# EAGLE design BMSMaster (EAGLE 6.6.0)

## Sheet 1 of 2
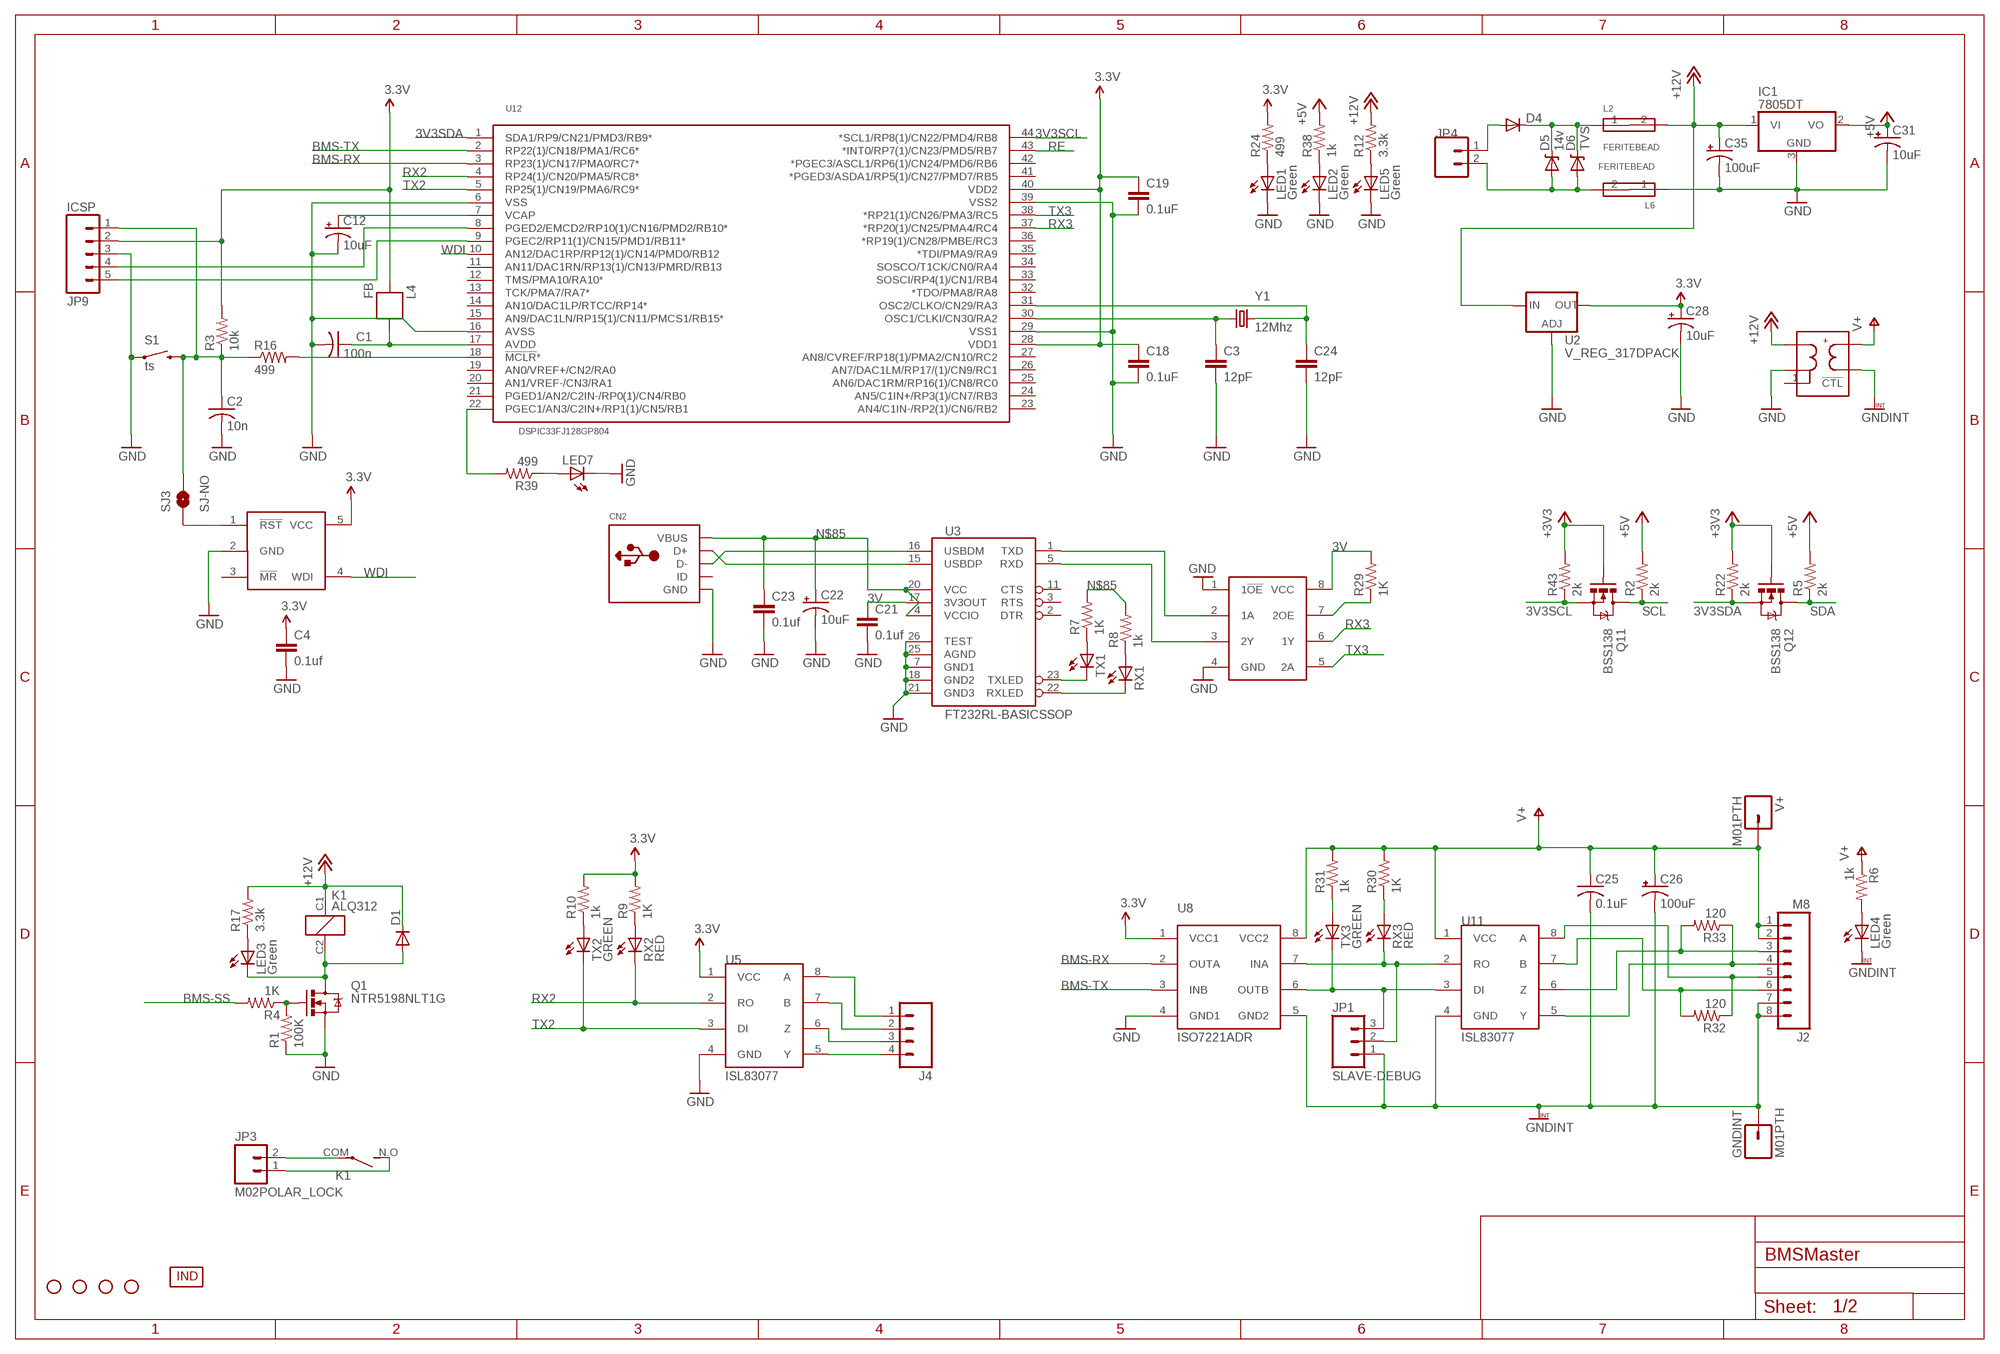
[diagram p0: schematic, sheet 1]

### Parts
C1  100n  C-USC0805  [C0805]
C2  10n  C-USC0805  [C0805]
C3  12pF  CAP0805  [0805]
C4  0.1uf  CAP0805  [0805]
C12  10uF  10UF-TANT  [EIA3216]
C18  0.1uF  CAP0805  [0805]
C19  0.1uF  CAP0805  [0805]
C21  0.1uf  CAP0805  [0805]
C22  10uF  CAP_POL1206  [EIA3216]
C23  0.1uf  CAP0805  [0805]
C24  12pF  CAP0805  [0805]
C25  0.1uF  C-USC0805  [C0805]
C26  100uF  CPOL-USC/6032-28W  [C/6032-28W]
C28  10uF  POLCAP  [POLC1206]
C31  10uF  10UF-16V-10%(TANT)  [EIA3216]
C35  100uF  CPOL-USCT7343  [CT7343]
CN2  USBMOLEX  [USB-MINIB-THM-MOLEX]
D1  DIODESMB  [SMB-DIODE]
D4  DIODESMA  [SMA-DIODE]
D5  14v  DIODE-ZENERSMB  [SMB-DIODE]
D6  TVS  [DO-214AC]
GNDINT  M01PTH  [1X01]
IC1  7805DT  [TO252]
J2  M8  [75869-132LF]
J4  M04POLAR_LOCK  [MOLEX-1X4_LOCK]
JP1  SLAVE-DEBUG  M03LOCK_LONGPADS  [1X03_LOCK_LONGPADS]
JP3  M02POLAR_LOCK  [MOLEX-1X2_LOCK]
JP4  M02POLAR_LOCK  [MOLEX-1X2_LOCK]
JP9  ICSP  M05LOCK_LONGPADS  [1X05_LOCK_LONGPADS]
K1  ALQ312  [ALQ312]
L2  FERITEBEAD  [0603]
L4  FB  [0603]
L6  FERITEBEAD  [0603]
LED1  Green  LEDCHIPLED_0805  [CHIPLED_0805]
LED2  Green  LEDCHIPLED_0805  [CHIPLED_0805]
LED3  Green  LEDCHIPLED_0805  [CHIPLED_0805]
LED4  Green  LEDCHIPLED_0805  [CHIPLED_0805]
LED5  Green  LEDCHIPLED_0805  [CHIPLED_0805]
LED7  LEDCHIP-LED0805  [CHIP-LED0805]
Q1  NTR5198NLT1G  MOSFET-NCHANNELBSS123LT1G  [SOT23]
Q11  BSS138  MOSFET-NCHANNELSMD  [SOT23-3]
Q12  BSS138  MOSFET-NCHANNELSMD  [SOT23-3]
R1  100K  R-US_R0805  [R0805]
R2  2k  R-US_R0805  [R0805]
R3  10k  RESISTOR0805-RES  [0805]
R4  1K  R-US_R0805  [R0805]
R5  2k  R-US_R0805  [R0805]
R6  1k  R-US_R0805  [R0805]
R7  1K  R-US_R0805  [R0805]
R8  1k  R-US_R0805  [R0805]
R9  1K  R-US_R0805  [R0805]
R10  1k  R-US_R0805  [R0805]
R12  3.3k  R-US_R0805  [R0805]
R16  499  RESISTOR0805-RES  [0805]
R17  3.3k  R-US_R0805  [R0805]
R22  2k  R-US_R0805  [R0805]
R24  499  R-US_R0805  [R0805]
R29  1K  R-US_R0805  [R0805]
R30  1K  R-US_R0805  [R0805]
R31  1k  R-US_R0805  [R0805]
R32  120  R-US_R0805  [R0805]
R33  120  R-US_R0805  [R0805]
R38  1k  R-US_R0805  [R0805]
R39  499  RESISTOR0805-RES  [0805]
R43  2k  R-US_R0805  [R0805]
RX1  LEDCHIPLED_0805  [CHIPLED_0805]
RX2  RED  LEDCHIPLED_0805  [CHIPLED_0805]
RX3  RED  LEDCHIPLED_0805  [CHIPLED_0805]
S1  ts  SWITCH-MOMENTARY-2SIDE_EZ  [TACTILE-PTH-SIDEEZ]
SJ3  SJ-NO  SOLDERJUMPERNO  [SJ_2S-NO]
STANDOFF1  STAND-OFF  [STAND-OFF]
STANDOFF2  STAND-OFF  [STAND-OFF]
STANDOFF3  STAND-OFF  [STAND-OFF]
STANDOFF4  STAND-OFF  [STAND-OFF]
TX1  LEDCHIPLED_0805  [CHIPLED_0805]
TX2  GREEN  LEDCHIPLED_0805  [CHIPLED_0805]
TX3  GREEN  LEDCHIPLED_0805  [CHIPLED_0805]
U2  V_REG_317DPACK  [V-REG_DPACK]
U3  FT232RL-BASICSSOP  [SSOP28DB]
U4  SN74LVC2G241DCTR  [VFSOP-8]
U5  ISL83077  [SO08]
U8  ISO7221ADR  [SOIC-8]
U9  MAX823  [SOT23-5L]
U11  ISL83077  [SO08]
U12  DSPIC33FJ128GP804  [TQFP-44]
U21  REC7.5-1205SRW/H2/A/M  [24DIPMOD-8LEAD]
U$1  INDPK1  [PICKIT-PIN-1]
V+  M01PTH  [1X01]
Y1  12Mhz  CRYSTAL5X3  [CRYSTAL-SMD-5X3]

### Nets
3.3V: C4.1 C18.1 C19.1 C28.1(+) JP9.2 L4.2 R3.2 R9.2 R10.2 R24.2 U2.4(OUT) U5.1(VCC) U8.1(VCC1) U9.5(VCC) U12.28(VDD1) U12.40(VDD2)
3V: C21.1 R29.2 U3.17(3V3OUT) U4.8(VCC)
3V3SCL: Q11.2(S) R43.1 U12.44(*SCL1/RP8(1)/CN22/PMD4/RB8)
3V3SDA: Q12.2(S) R22.1 U12.1(SDA1/RP9/CN21/PMD3/RB9*)
+3V3: Q11.1(G) Q12.1(G) R22.2 R43.2
+5V: C31.A(+) IC1.2(VO) R2.2 R5.2 R38.2 ; also sheet 2
+12V: C35.+ D1.C IC1.1(VI) K1.C1(+) L2.2 R12.2 R17.2 U2.3(IN) U21.22(VIN+) U21.23(VIN+)
BMS-RX: U8.2(OUTA) U12.3(RP23(1)/CN17/PMA0/RC7*)
BMS-SS: R4.2
BMS-TX: U8.3(INB) U12.2(RP22(1)/CN18/PMA1/RC6*)
GND: C1.2 C2.2 C3.2 C4.2 C12.C(-) C18.2 C19.2 C21.2 C22.C(-) C23.2 C24.2 C28.2(-) C31.C(-) C35.- CN2.GND IC1.3(GND) JP9.3 L6.1 LED1.C LED2.C LED5.C LED7.C Q1.2(S) R1.1 S1.1 U2.1(ADJ) U3.7(GND1) U3.18(GND2) U3.21(GND3) U3.25(AGND) U3.26(TEST) U4.1(1!OE) U4.4(GND) U5.4(GND) U8.4(GND1) U9.2(GND) U12.6(VSS) U12.16(AVSS) U12.29(VSS1) U12.39(VSS2) U21.2(VIN-) U21.3(VIN-) ; also sheet 2
GNDINT: C25.2 C26.- GNDINT.1 J2.7 J2.8 JP1.1 LED4.C U8.5(GND2) U11.4(GND) U21.16(VOUT-)
N$1: LED7.A R39.1
N$2: C24.1 U12.31(OSC2/CLKO/CN29/RA3) Y1.3
N$3: J4.4 U5.5(Y)
N$4: C3.1 U12.30(OSC1/CLKI/CN30/RA2) Y1.1
N$5: SJ3.1 U9.1(!RST)
N$6: CN2.D- U3.16(USBDM)
N$7: LED1.A R24.1
N$8: CN2.D+ U3.15(USBDP)
N$9: LED5.A R12.1
N$10: R7.1 TX1.A
N$11: J4.3 U5.6(Z)
N$12: J4.2 U5.7(B)
N$13: J4.1 U5.8(A)
N$14: R8.1 RX1.A
N$15: TX1.C U3.23(TXLED)
N$16: RX1.C U3.22(RXLED)
N$17: R10.1 TX2.A
N$18: U3.1(TXD) U4.2(1A)
N$19: JP3.2 K1.COM(P)
N$20: U3.5(RXD) U4.3(2Y)
N$21: C1.1 L4.1 U12.17(AVDD)
N$22: LED2.A R38.1
N$23: JP3.1 K1.N.O(S)
N$25: J2.3 R33.2 U11.6(Z)
N$27: C12.A(+) U12.7(VCAP)
N$28: LED4.A R6.2
N$32: D1.A K1.C2(-) LED3.C Q1.3(D)
N$39: Q1.1(G) R1.2 R4.1
N$40: R9.1 RX2.A
N$41: J2.4 R33.1 U11.5(Y)
N$42: J2.5 R32.1 U11.8(A)
N$43: J2.6 R32.2 U11.7(B)
N$44: R39.2 U12.22(PGEC1/AN3/C2IN+/RP1(1)/CN5/RB1)
N$45: C2.1 JP9.1 R3.1 R16.1 S1.2 SJ3.2
N$46: R16.2 U12.18(!MCLR!*)
N$47: JP9.4 U12.8(PGED2/EMCD2/RP10(1)/CN16/PMD2/RB10*)
N$48: JP9.5 U12.9(PGEC2/RP11(1)/CN15/PMD1/RB11*)
N$49: LED3.A R17.1
N$69: R29.1 U4.7(2OE)
N$73: R30.1 RX3.A
N$74: R31.1 TX3.A
N$85: C22.A(+) C23.1 CN2.VBUS R7.2 R8.2 U3.4(VCCIO) U3.20(VCC)
N$88: D5.A D6.A JP4.2 L6.2
N$89: D4.A JP4.1
N$91: D4.C D5.C D6.C L2.1
PIC1: JP1.2 RX3.C U8.7(INA) U11.2(RO)
PIC2: JP1.3 TX3.C U8.6(OUTB) U11.3(DI)
RE: U12.43(*INT0/RP7(1)/CN23/PMD5/RB7)
RX2: RX2.C U5.2(RO) U12.4(RP24(1)/CN20/PMA5/RC8*)
RX3: U4.6(1Y) U12.37(*RP20(1)/CN25/PMA4/RC4)
SCL: Q11.3(D) R2.1 ; also sheet 2
SDA: Q12.3(D) R5.1 ; also sheet 2
TX2: TX2.C U5.3(DI) U12.5(RP25(1)/CN19/PMA6/RC9*)
TX3: U4.5(2A) U12.38(*RP21(1)/CN26/PMA3/RC5)
V+: C25.1 C26.+ J2.1 J2.2 R6.1 R30.2 R31.2 U8.8(VCC2) U11.1(VCC) U21.14(VOUT+) V+.1
WDI: U9.4(WDI) U12.10(AN12/DAC1RP/RP12(1)/CN14/PMD0/RB12)
Unconnected: CN2.ID U3.2(DTR) U3.3(RTS) U3.11(CTS) U9.3(!MR) U12.11(AN11/DAC1RN/RP13(1)/CN13/PMRD/RB13) U12.12(TMS/PMA10/RA10*) U12.13(TCK/PMA7/RA7*) U12.14(AN10/DAC1LP/RTCC/RP14*) U12.15(AN9/DAC1LN/RP15(1)/CN11/PMCS1/RB15*) U12.19(AN0/VREF+/CN2/RA0) U12.20(AN1/VREF-/CN3/RA1) U12.21(PGED1/AN2/C2IN-/RP0(1)/CN4/RB0) U12.23(AN4/C1IN-/RP2(1)/CN6/RB2) U12.24(AN5/C1IN+/RP3(1)/CN7/RB3) U12.25(AN6/DAC1RM/RP16(1)/CN8/RC0) U12.26(AN7/DAC1LM/RP17/(1)/CN9/RC1) U12.27(AN8/CVREF/RP18(1)/PMA2/CN10/RC2) U12.32(*TDO/PMA8/RA8) U12.33(SOSCI/RP4(1)/CN1/RB4) U12.34(SOSCO/T1CK/CN0/RA4) U12.35(*TDI/PMA9/RA9) U12.36(*RP19(1)/CN28/PMBE/RC3) U12.41(*PGED3/ASDA1/RP5(1)/CN27/PMD7/RB5) U12.42(*PGEC3/ASCL1/RP6(1)/CN24/PMD6/RB6) U21.1(!CTL)

## Sheet 2 of 2
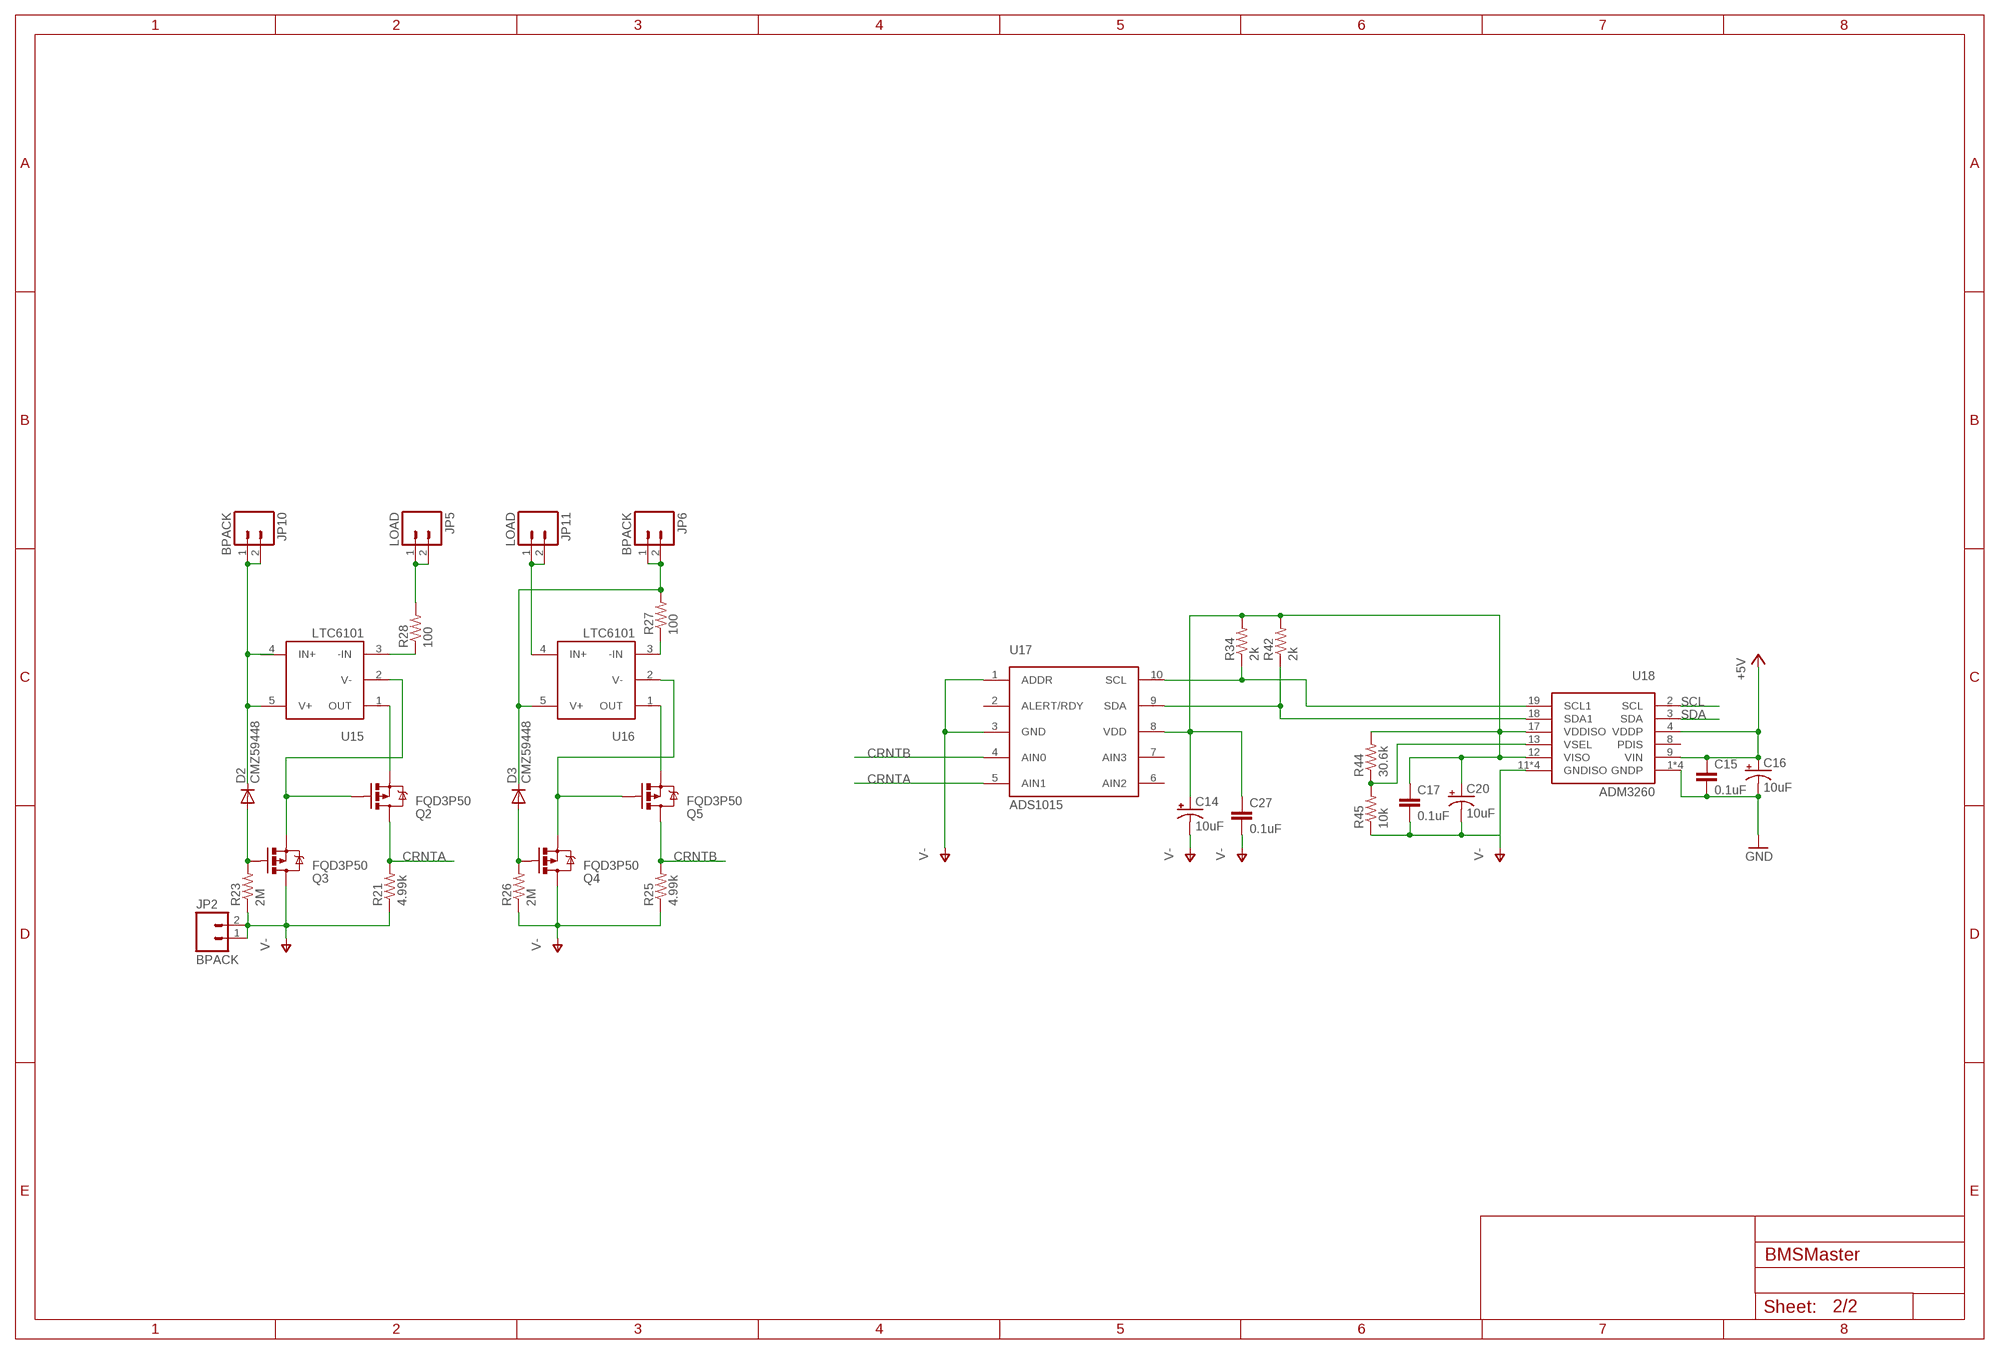
[diagram p1: schematic, sheet 2]

### Parts
C14  10uF  CAP_POL1206  [EIA3216]
C15  0.1uF  CAP0805  [0805]
C16  10uF  CAP_POL1206  [EIA3216]
C17  0.1uF  CAP0805  [0805]
C20  10uF  CAP_POL1206  [EIA3216]
C27  0.1uF  CAP0805  [0805]
D2  CMZ59448  DIODEHV  [DIODE-HV]
D3  CMZ59448  DIODEHV  [DIODE-HV]
JP2  BPACK  M02POLAR_LOCK  [MOLEX-1X2_LOCK]
JP5  LOAD  M02POLAR_LOCK  [MOLEX-1X2_LOCK]
JP6  BPACK  M02POLAR_LOCK  [MOLEX-1X2_LOCK]
JP10  BPACK  M02POLAR_LOCK  [MOLEX-1X2_LOCK]
JP11  LOAD  M02POLAR_LOCK  [MOLEX-1X2_LOCK]
Q2  FQD3P50  [DPAK]
Q3  FQD3P50  [DPAK]
Q4  FQD3P50  [DPAK]
Q5  FQD3P50  [DPAK]
R21  4.99k  RESISTOR1206  [1206]
R23  2M  RESISTOR1206  [1206]
R25  4.99k  RESISTOR1206  [1206]
R26  2M  RESISTOR1206  [1206]
R27  100  RESISTOR1206  [1206]
R28  100  RESISTOR1206  [1206]
R34  2k  RESISTOR0805-RES  [0805]
R42  2k  RESISTOR0805-RES  [0805]
R44  30.6k  RESISTOR0805-RES  [0805]
R45  10k  RESISTOR0805-RES  [0805]
U15  LTC6101  [SOT23-5]
U16  LTC6101  [SOT23-5]
U17  ADS1015  [MSOP-10]
U18  ADM3260  [SSOP-20]

### Nets
+5V: C15.1 C16.A(+) U18.4(VDDP) U18.9(VIN) ; also sheet 1
CRNTA: Q2.2(D) R21.2 U17.5(AIN1)
CRNTB: Q5.2(D) R25.2 U17.4(AIN0)
GND: C15.2 C16.C(-) U18.1(GNDP) U18.5(GNDP) U18.7(GNDP) U18.10(GNDP) ; also sheet 1
N$24: D3.C JP6.1 JP6.2 R27.2 U16.5(V+)
N$29: JP5.1 JP5.2 R28.2
N$55: D2.C JP10.1 JP10.2 U15.4(IN+) U15.5(V+)
N$56: D3.A Q4.1(G) R26.2
N$57: C14.A(+) C17.1 C20.A(+) C27.1 R34.2 R42.2 R44.2 U17.8(VDD) U18.12(VISO) U18.17(VDDISO)
N$58: JP11.1 JP11.2 U16.4(IN+)
N$59: D2.A Q3.1(G) R23.2
N$60: R34.1 U17.10(SCL) U18.19(SCL1)
N$61: R27.1 U16.3(-IN)
N$62: Q2.1(G) Q3.3(S) U15.2(V-)
N$63: Q2.3(S) U15.1(OUT)
N$64: Q5.3(S) U16.1(OUT)
N$65: Q4.3(S) Q5.1(G) U16.2(V-)
N$66: R28.1 U15.3(-IN)
N$67: R42.1 U17.9(SDA) U18.18(SDA1)
N$68: R44.1 R45.2 U18.13(VSEL)
SCL: U18.2(SCL) ; also sheet 1
SDA: U18.3(SDA) ; also sheet 1
V-: C14.C(-) C17.2 C20.C(-) C27.2 JP2.1 JP2.2 Q3.2(D) Q4.2(D) R21.1 R23.1 R25.1 R26.1 R45.1 U17.1(ADDR) U17.3(GND) U18.11(GNDISO) U18.14(GNDISO) U18.16(GNDISO) U18.20(GNDISO)
Unconnected: U17.2(ALERT/RDY) U17.6(AIN2) U17.7(AIN3) U18.8(PDIS)

## Library data of the parts
C1 C2 = adafruit:C-US: CAPACITOR, American symbol
C3 C15 C17-C19 C24 C27 = SparkFun-Capacitors:CAP: Capacitor Standard 0603 ceramic capacitor, and 0.1" leaded capacitor.
C4 C21 C23 = SparkFun:CAP: Capacitor Standard 0603 ceramic capacitor, and 0.1" leaded capacitor.
C12 = SparkFun-Capacitors:10UF-TANT: 10uF Tantalum SMT CAP-00811- 16V 10% (EIA-3216); PROD_ID: CAP-00811
C14 C16 C20 = SparkFun-Capacitors:CAP_POL: Capacitor Polarized These are standard SMD and PTH capacitors. Normally 10uF, 47uF, and 100uF in electrolytic and tantalum varieties. Always verify the external diameter of the through hole cap, it varies with capacity, voltage, and manufacturer. The EIA devices should be standard.
C22 = SparkFun:CAP_POL: Capacitor Polarized These are standard SMD and PTH capacitors. Normally 10uF, 47uF, and 100uF in electrolytic and tantalum varieties. Always verify the external diameter of the through hole cap, it varies with capacity, voltage, and manufacturer. The EIA devices should be standard.
C25 = rcl:C-US: CAPACITOR, American symbol
C26 = rcl:CPOL-US: POLARIZED CAPACITOR, American symbol
C28 = RJ's_parts:POLCAP
C31 = SparkFun-Capacitors:10UF-16V-10%(TANT): CAP-00811 1206/EIA-3216 Tantalum capacitor; PROD_ID: CAP-00811
C35 = adafruit:CPOL-US: POLARIZED CAPACITOR, American symbol
CN2 = adafruit:USB: USB Connectors USBMINIB - Surface Mount Female Mini-B USB Connector 4UConnector: 06564 By microbuilder.eu Thru-hole RA Female Mini-B USB Connector 4UConnector: 18732 By ladyada.net
D1-D4 = SparkFun-DiscreteSemi:DIODE: Diode These are standard reverse protection diodes and small signal diodes. SMA package can handle up to about 1A. SOD-323 can handle about 200mA. What the SOD-323 package when ordering, there are some mfgs out there that are 5-pin packages.
D5 = SparkFun-DiscreteSemi:DIODE-ZENER: Zener Diode Production Part - 8199 3.4V Zener Voltage
D6 = NASA_LIB:TVS
GNDINT V+ = SparkFun-Connectors:M01: Header 1 Standard 1-pin 0.1" header. Use with straight break away headers (SKU : PRT-00116), right angle break away headers (PRT-00553), swiss pins (PRT-00743), machine pins (PRT-00117), and female headers (PRT-00115).
IC1 = adafruit:78*: Positive VOLTAGE REGULATOR Added bigger pads to the TO-92 package
J2 = FSAE Eletric:M8
J4 = SparkFun-Connectors:M04: Header 4 Standard 4-pin 0.1" header. Use with straight break away headers (SKU : PRT-00116), right angle break away headers (PRT-00553), swiss pins (PRT-00743), machine pins (PRT-00117), and female headers (PRT-00115). Molex polarized connector foot print use with SKU : PRT-08231 with associated crimp pins and housings. 1MM SMD Version SKU: PRT-10208
JP1 = SparkFun-Connectors:M03: Header 3 Standard 3-pin 0.1" header. Use with straight break away headers (SKU : PRT-00116), right angle break away headers (PRT-00553), swiss pins (PRT-00743), machine pins (PRT-00117), and female headers (PRT-00115). Molex polarized connector foot print use with SKU : PRT-08232 with associated crimp pins and housings.
JP2-JP6 JP10 JP11 = SparkFun-Connectors:M02: Standard 2-pin 0.1" header. Use with - straight break away headers ( PRT-00116) - right angle break away headers (PRT-00553) - swiss pins (PRT-00743) - machine pins (PRT-00117) - female headers (PRT-00115) Molex polarized connector foot print use with: PRT-08233 with associated crimp pins and housings. 2.54_SCREWTERM for use with PRT-10571. 3.5mm Screw Terminal footprints for PRT-08084 5mm Screw Terminal footprints for use with PRT-08433
JP9 = SparkFun-Connectors:M05: Header 5 Standard 5-pin 0.1" header. Use with straight break away headers (SKU : PRT-00116), right angle break away headers (PRT-00553), swiss pins (PRT-00743), machine pins (PRT-00117), and female headers (PRT-00115). Molex polarized connector foot print use with SKU : PRT-08230 with associated crimp pins and housings.
K1 = FSAE Eletric:ALQ312
L2 L6 = EmEndev:FERITEBEAD
L4 = SparkFun-Passives:FB
LED1-LED5 LED7 RX1-RX3 TX1-TX3 = adafruit:LED: LED OSRAM: - CHIPLED LG R971, LG N971, LY N971, LG Q971, LY Q971, LO R971, LY R971 LH N974, LH R974 LS Q976, LO Q976, LY Q976 LO Q996 - Hyper CHIPLED LW Q18S LB Q993, LB Q99A, LB R99A - SideLED LS A670, LO A670, LY A670, LG A670, LP A670 LB A673, LV A673, LT A673, LW A673 LH A674 LY A675 LS A676, LA A676, LO A676, LY A676, LW A676 LS A679, LY A679, LG A679 - Hyper Micro SIDELED® LS Y876, LA Y876, LO Y876, LY Y876 LT Y87S - SmartLED LW L88C, LW L88S LB L89C, LB L89S, LG L890 LS L89K, LO L89K, LY L89K LS L896, LA L896, LO L896, LY L896 - TOPLED LS T670, LO T670, LY T670, LG T670, LP T670 LSG T670, LSP T670, LSY T670, LOP T670, LYG T670 LG T671, LOG T671, LSG T671 LB T673, LV T673, LT T673, LW T673 LH T674 LS T676, LA T676, LO T676, LY T676, LB T676, LH T676, LSB T676, LW T676 LB T67C, LV T67C, LT T67C, LS T67K, LO T67K, LY T67K, LW E67C LS E67B, LA E67B, LO E67B, LY E67B, LB E67C, LV E67C, LT E67C LW T67C LS T679, LY T679, LG T679 LS T770, LO T770, LY T770, LG T770, LP T770 LB T773, LV T773, LT T773, LW T773 LH T774 LS E675, LA E675, LY E675, LS T675 LS T776, LA T776, LO T776, LY T776, LB T776 LHGB T686 LT T68C, LB T68C - Hyper Mini TOPLED® LB M676 - Mini TOPLED Santana® LG M470 LS M47K, LO M47K, LY M47K Source: http://www.osram.convergy.de/
Q1 = SparkFun-DiscreteSemi:MOSFET-NCHANNEL: Common NMOSFET Parts MFG P/N Store ID Prod ID FDD8780 TRANS-09984 SI7820DN TRANS-11055 FDS6630A IC-08089 2N7002PW TRANS-11151 FQP30N06L COM-10213 TRANS-10060 BSS123LT1G TRANS-08345 BSS138 TRANS-00830 BS170 2N7000; PROD_ID: TRANS-08345
Q2-Q5 = FSAE Eletric:FQD3P50
Q11 Q12 = SparkFun:MOSFET-NCHANNEL
R1 R2 R4-R10 R12 R17 R22 R24 R29-R33 R38 R43 = adafruit:R-US_: RESISTOR, American symbol
R3 R21 R23 R25-R28 R34 R39 R42 R44 R45 = SparkFun-Passives:RESISTOR: Resistor Basic schematic elements and footprints for 0603, 1206, and PTH resistors.
R16 = SparkFun-Resistors:RESISTOR: Resistor Basic schematic elements and footprints for 0603, 1206, and PTH resistors.
S1 = SparkFun-Electromechanical:SWITCH-MOMENTARY-2: Various NO switches- pushbuttons, reed, etc
SJ3 = SparkFun-Passives:SOLDERJUMPER: Solder Jumper Standard SMD solder jumper. Used to automate production. Two varients : Normally Open and Normally Closed are the same, but have different paste layers. NC will have a large amount of paste and should jumper during reflow.
STANDOFF1-STANDOFF4 = SparkFun-Electromechanical:STAND-OFF: #4 Stand Off This is the mechanical footprint for a #4 phillips button head screw. Use the keepout ring to avoid running the screw head into surrounding components. SKU : PRT-00447
U2 = SparkFun-PowerIC:V_REG_317: Voltage Regulator Standard LM317 adjustable voltage regulator. AOI (Adjust Output Input). Google 'LM317 Calculator' for easy to use app to get the two resistor values needed. 240/720 for 5V output. 240/390 for 3.3V output. Spark Fun Electronics SKU : COM-00527
U3 = SparkFun:FT232RL-BASIC: USB UART This is the simplified version of the FT232RL unit. Only what you need, nothing you don't. Spark Fun Electronics SKU : COM-00650
U4 = Cleaverbrooks:SN74LVC2G241DCTR
U5 U11 = NASA_LIB:ISL83077
U8 = Gasbarre:ISO7221ADR
U9 = NASA_LIB:MAX823
U12 = FSAE Eletric:DSPIC33FJ128GP804
U15 U16 = FSAE Eletric:LTC6101
U17 = NASA_LIB:ADS1015
U18 = FSAE Eletric:ADM3260
U21 = FSAE Eletric:REC7.5-1205SRW/H2/A/M
U$1 = FSAE Eletric (2):IND
Y1 = SparkFun-FreqCtrl:CRYSTAL: Various standard crystals. Proven footprints. Spark Fun Electronics SKU : COM-00534

## Board
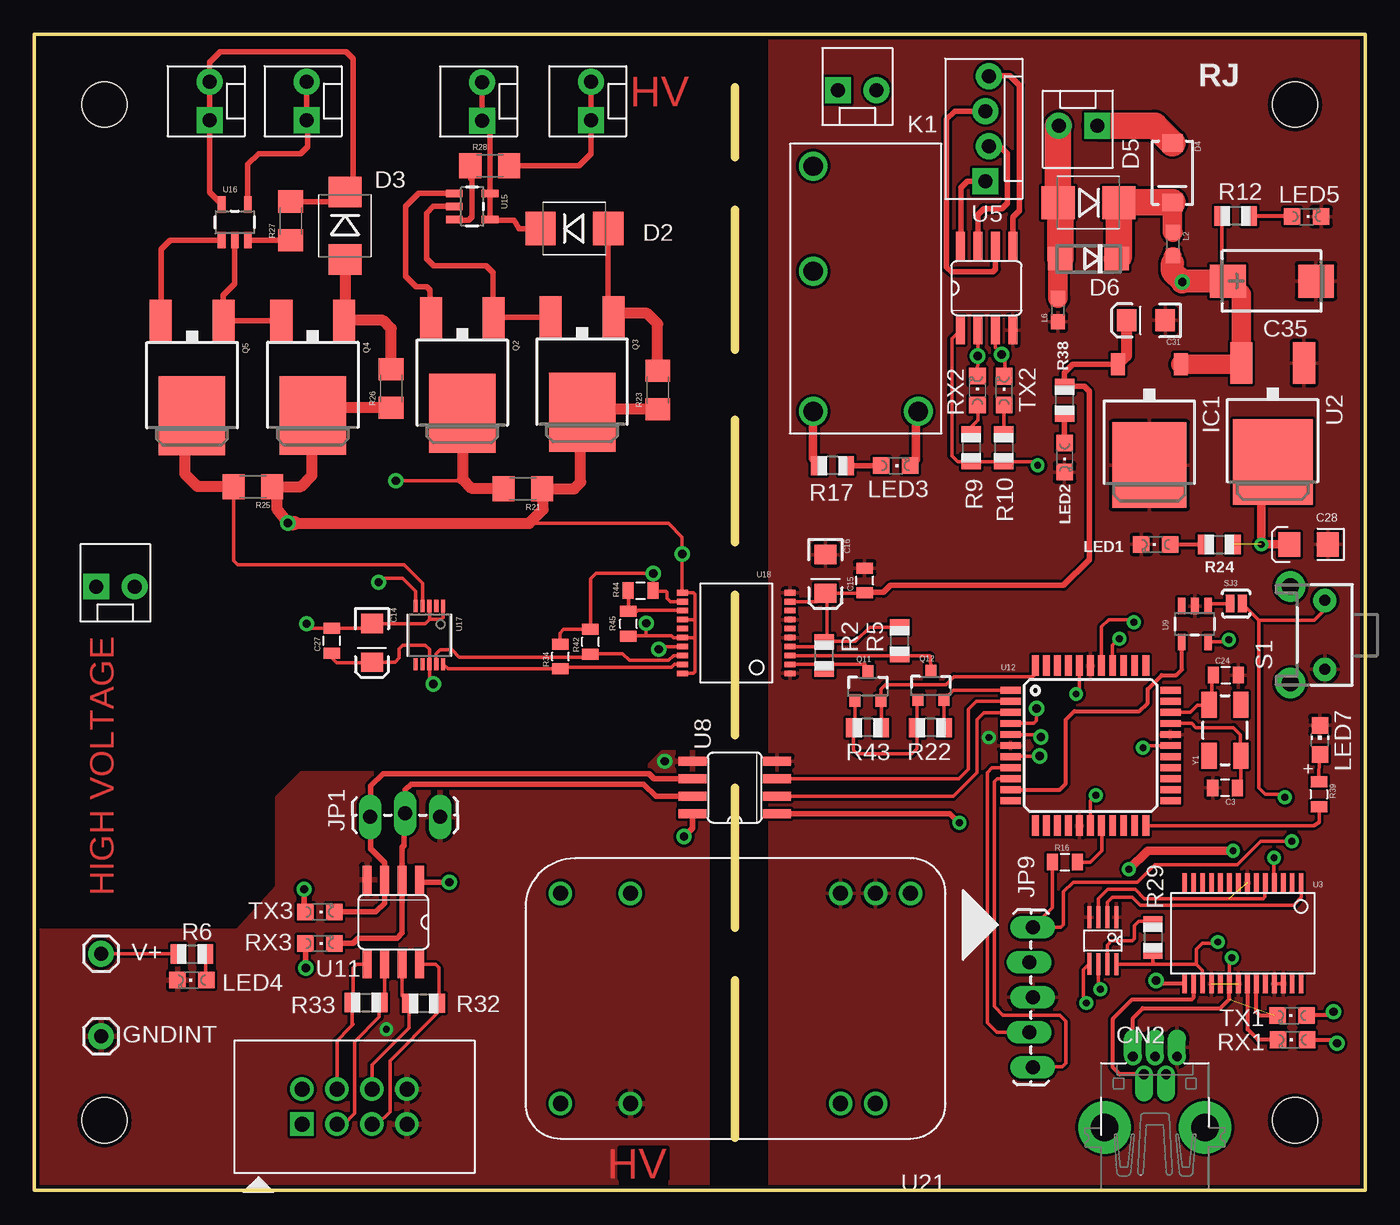
[diagram p2: board, top side]
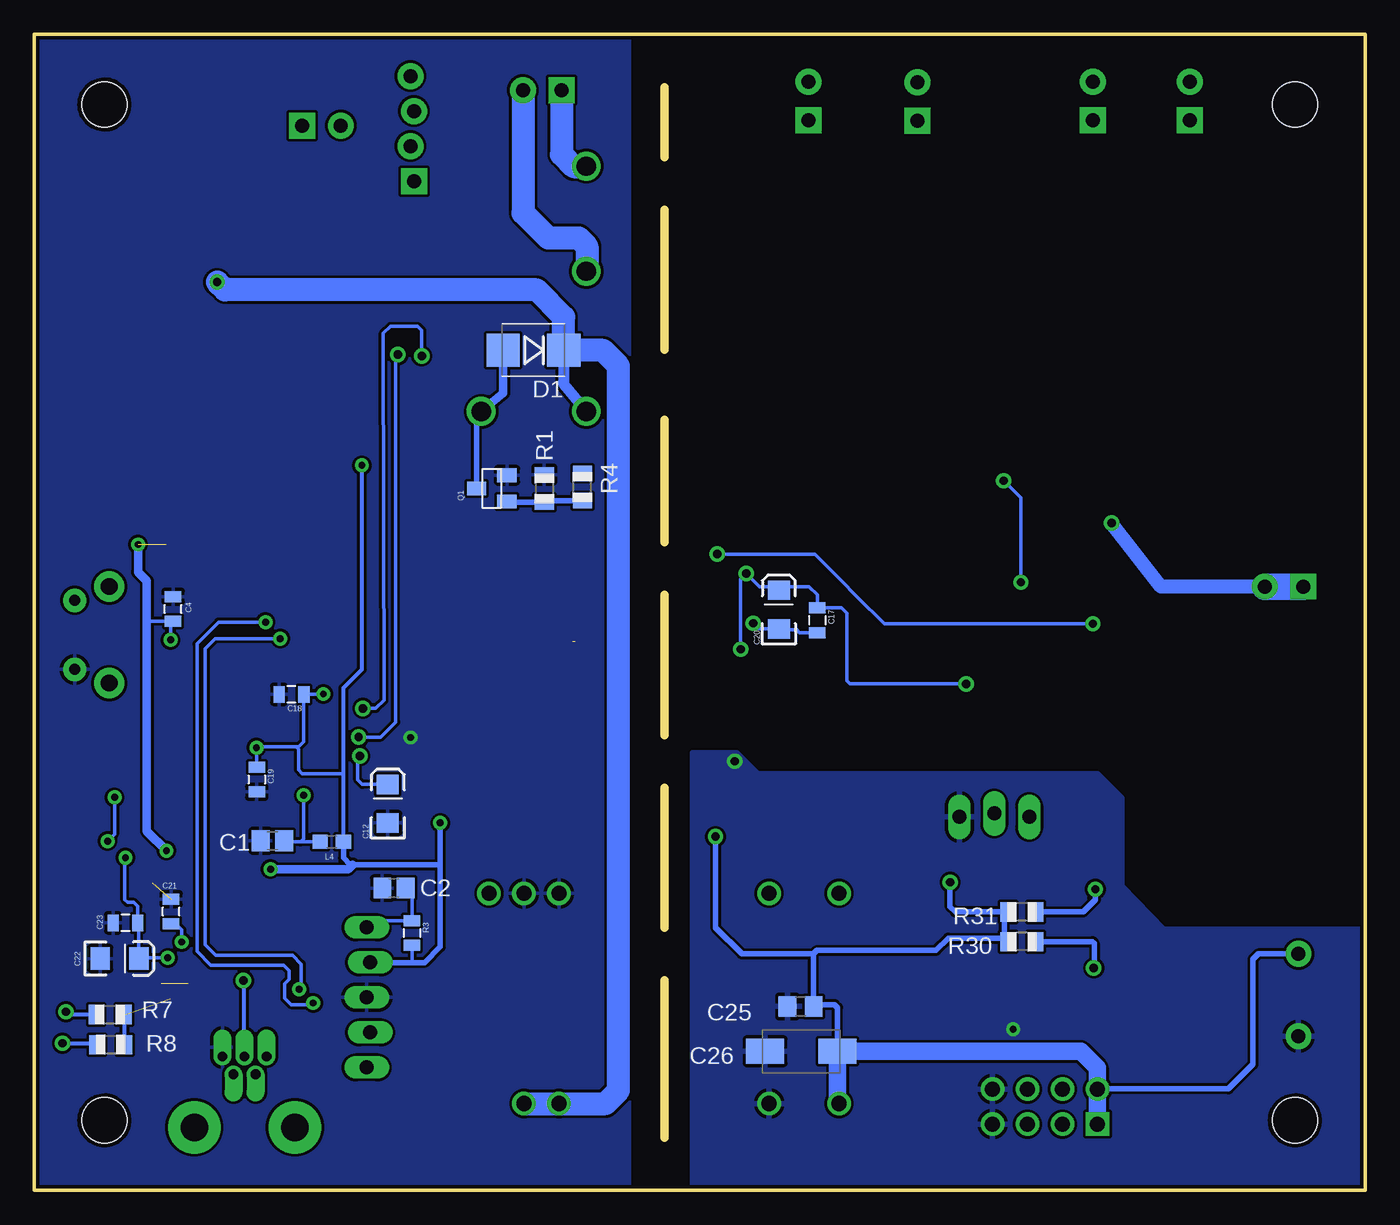
[diagram p3: board, bottom side, seen from below]

Size 96.52 x 83.82 mm. Coordinates in mm from the lower left corner, seen from the top.
Outline: 50.8,3.81 50.8,15.24
Outline: 50.8,19.05 50.8,29.21
Outline: 50.8,33.02 50.8,43.18
Outline: 50.8,46.99 50.8,55.88
Outline: 50.8,60.96 50.8,71.12
Outline: 50.8,74.93 50.8,80.01
Outline: 0,83.82 96.52,83.82 96.52,0 0,0 0,83.82
Copper layers (1*16): Top 0.035mm / dielectric 1.5mm / Bottom 0.035mm
Design rules "default": minimum track width 8mil, minimum drill 20mil, track to track 8mil, track to pad 8mil, pad to pad 8mil, via to via 8mil, smd to smd 8mil, copper to edge 10mil, drill to drill 8mil, minimum pad ring 12mil, minimum via ring 10mil, stop-mask expansion 4mil, vias tented up to drill 25mil, thermal gap 10mil

### Footprints (pad centres in the part's own frame; a part is rotated, then mirrored left to right if it is on the bottom)
C0805 = smd 1.3 x 1.5: 1 -0.85,0; 2 0.85,0
0805 = smd 0.8 x 1.2: 1 -0.9,0; 2 0.9,0
EIA3216 = smd 1.4 x 1.6: A 1.4,0; C -1.4,0
C0805' = smd 1.3 x 1.5: 1 -0.95,0; 2 0.95,0
C/6032-28W = smd 2.75 x 1.8: + 2.625,0; - -2.625,0
POLC1206 = smd 1.6 x 1.8: 1 -1.4,0; 2 1.4,0
CT7343 = smd 2.6 x 2.4: + 3.2,0; - -3.2,0
USB-MINIB-THM-MOLEX = drill 0.7 offset: D+ 0,9.72; D- -0.8,8.42; GND 1.6,9.72; ID 0.8,8.42; VBUS -1.6,9.72 | drill 2 pad 3.81: GND1 -3.65,4.57; GND4 3.65,4.57
SMB-DIODE = smd 2.4 x 2.4: A 2.2,0; C -2.2,0
DIODE-HV = smd 2.2 x 2.4: A 2.454,0; C -2.454,0
SMA-DIODE = smd 1.27 x 1.47: A -2.15,0; C 2.15,0
DO-214AC = smd 1.8 x 1.7: A 2.05,0; C -2.05,0
1X01 = drill 1.016 pad 1.88: 1 0,0
TO252 = smd 1 x 1.6: 1 -2.28,-4.8; 2 2.28,-4.8 | smd 5.4 x 6.2: 3 0,2.5
75869-132LF = drill 1.1 square: 1 -3.81,-1.27 | drill 1.1: 2 -3.81,1.27; 3 -1.27,-1.27; 4 -1.27,1.27; 5 1.27,-1.27; 6 1.27,1.27; 7 3.81,-1.27; 8 3.81,1.27
MOLEX-1X4_LOCK = drill 1.016 pad 1.88 square: 1 0,0.127 | drill 1.016 pad 1.88: 2 2.54,-0.127; 3 5.08,0.127; 4 7.62,-0.127
1X03_LOCK_LONGPADS = drill 1.016 long: 1 0,0; 2 2.54,-0.254; 3 5.08,0
MOLEX-1X2_LOCK = drill 1.016 pad 1.88 square: 1 -0.127,0 | drill 1.016 pad 1.88: 2 2.667,0
1X05_LOCK_LONGPADS = drill 1.016 long: 1 0,0; 2 2.54,-0.254; 3 5.08,0; 4 7.62,-0.254; 5 10.16,0
ALQ312 = drill 1.4: C1 -8.89,3.81; C2 -8.89,-3.81; COM 1.27,3.81; N.O 8.89,3.81
0603 = smd 1.1 x 1: 1 -0.85,0; 2 0.85,0
CHIPLED_0805 = smd 1.2 x 1.2: A 0,-1.05; C 0,1.05
CHIP-LED0805 = smd 1.2 x 1.2: A 0,-1.05; C 0,1.05
SOT23 = smd 1 x 1.4: 1 -0.95,-1.1; 2 0.95,-1.1; 3 0,1.1
DPAK = smd 1.6 x 3: 1 -2.28,-4.04; 3 2.28,-4.04 | smd 4.826 x 5.715: 2 0,2.858
SOT23-3 = smd 0.8 x 0.9: 1 -0.95,-1; 2 0.95,-1; 3 0,1.1
R0805 = smd 1.1 x 1.4: 1 -1,0; 2 1,0
1206 = smd 1.6 x 1.8: 1 -1.4,0; 2 1.4,0
TACTILE-PTH-SIDEEZ = drill 0.8 pad 1.7: 1 -2.5,0; 2 2.5,0 | drill 1.2 pad 2.2: ANCHOR1 -3.5,2.5; ANCHOR2 3.5,2.5
SJ_2S-NO = smd 0.635 x 1.27: 1 -0.45,0; 2 0.45,0
STAND-OFF = hole 3.302: 0,0
V-REG_DPACK = smd 1.6 x 3: 1 -2.28,-4.8; 3 2.28,-4.8 | smd 5.8 x 6.2: 4 0,2.38
SSOP28DB = smd 0.348 x 1.397: 1 -4.225,-3.656; 2 -3.575,-3.656; 3 -2.925,-3.656; 4 -2.275,-3.656; 5 -1.625,-3.656; 6 -0.975,-3.656; 7 -0.325,-3.656; 8 0.325,-3.656; 9 0.975,-3.656; 10 1.625,-3.656; 11 2.275,-3.656; 12 2.925,-3.656; 13 3.575,-3.656; 14 4.225,-3.656; 15 4.225,3.656; 16 3.575,3.656; 17 2.925,3.656; 18 2.275,3.656; 19 1.625,3.656; 20 0.975,3.656; 21 0.325,3.656; 22 -0.325,3.656; 23 -0.975,3.656; 24 -1.625,3.656; 25 -2.275,3.656; 26 -2.925,3.656; 27 -3.575,3.656; 28 -4.225,3.656
VFSOP-8 = smd 0.3 x 1.6: 1 -0.98,-1.7; 2 -0.33,-1.7; 3 0.33,-1.7; 4 0.98,-1.7; 5 0.97,1.69; 6 0.325,1.7; 7 -0.33,1.7; 8 -0.98,1.71
SO08 = smd 0.66 x 2.032: 1 -1.905,-3.073; 2 -0.635,-3.073; 3 0.635,-3.073; 4 1.905,-3.073; 5 1.905,3.073; 6 0.635,3.073; 7 -0.635,3.073; 8 -1.905,3.073
SOIC-8 = smd 0.66 x 2.032: 1 -1.905,-3.073; 2 -0.635,-3.073; 3 0.635,-3.073; 4 1.905,-3.073; 5 1.905,3.073; 6 0.635,3.073; 7 -0.635,3.073; 8 -1.905,3.073
SOT23-5L = smd 0.55 x 1.2: 1 -0.95,-1.3; 2 0,-1.3; 3 0.95,-1.3; 4 0.95,1.3; 5 -0.95,1.3
TQFP-44 = smd 1.5 x 0.5: 1 -5.8,4; 2 -5.8,3.2; 3 -5.8,2.4; 4 -5.8,1.6; 5 -5.8,0.8; 6 -5.8,0; 7 -5.8,-0.8; 8 -5.8,-1.6; 9 -5.8,-2.4; 10 -5.8,-3.2; 11 -5.8,-4; 23 5.8,-4; 24 5.8,-3.2; 25 5.8,-2.4; 26 5.8,-1.6; 27 5.8,-0.8; 28 5.8,0; 29 5.8,0.8; 30 5.8,1.6; 31 5.8,2.4; 32 5.8,3.2; 33 5.8,4 | smd 0.5 x 1.5: 12 -4,-5.8; 13 -3.2,-5.8; 14 -2.4,-5.8; 15 -1.6,-5.8; 16 -0.8,-5.8; 17 0,-5.8; 18 0.8,-5.8; 19 1.6,-5.8; 20 2.4,-5.8; 21 3.2,-5.8; 22 4,-5.8; 34 4,5.8; 35 3.2,5.8; 36 2.4,5.8; 37 1.6,5.8; 38 0.8,5.8; 39 0,5.8; 40 -0.8,5.8; 41 -1.6,5.8; 42 -2.4,5.8; 43 -3.2,5.8; 44 -4,5.8
SOT23-5 = smd 0.55 x 1.2: 1 -0.95,-1.3; 2 0,-1.3; 3 0.95,-1.3; 4 0.95,1.3; 5 -0.95,1.3
MSOP-10 = smd 0.305 x 0.889: 1 -1,-2.11; 2 -0.5,-2.11; 3 0,-2.11; 4 0.5,-2.11; 5 1,-2.11; 6 1,2.11; 7 0.5,2.11; 8 0,2.11; 9 -0.5,2.11; 10 -1,2.11
SSOP-20 = smd 0.813 x 0.406: 1 -3.9,2.925; 2 -3.9,2.275; 3 -3.9,1.625; 4 -3.9,0.975; 5 -3.9,0.325; 6 -3.9,-0.325; 7 -3.9,-0.975; 8 -3.9,-1.625; 9 -3.9,-2.275; 10 -3.9,-2.925; 11 3.9,-2.925; 12 3.9,-2.275; 13 3.9,-1.625; 14 3.9,-0.975; 15 3.9,-0.325; 16 3.9,0.325; 17 3.9,0.975; 18 3.9,1.625; 19 3.9,2.275; 20 3.9,2.925
24DIPMOD-8LEAD = drill 1.1 pad 1.676: 1 0,0; 2 2.54,0; 3 5.08,0; 9 20.32,0; 11 25.4,0; 14 25.4,15.24; 16 20.32,15.24; 22 5.08,15.24; 23 2.54,15.24
CRYSTAL-SMD-5X3 = smd 1.9 x 1.1: 1 -1.85,-1.15; 2 1.85,-1.15; 3 1.85,1.15; 4 -1.85,1.15

### Placement (x,y rotation side)
C1  79.25,25.35 180 bottom
C2  70.43,21.92 180 bottom
C3  86.36,29.18 180 top
C4  86.46,42.16 90 bottom
C12  70.89,28.04 90 bottom
C14  24.49,39.7 270 top
C15  60.22,44.22 90 top
C16  57.38,44.7 270 top
C17  39.73,41.35 270 bottom
C18  77.88,35.97 180 bottom
C19  80.39,29.79 270 bottom
C20  42.52,42.11 90 bottom
C21  86.61,20.22 90 bottom
C22  90.35,16.81 0 bottom
C23  89.92,19.41 180 bottom
C24  86.41,37.36 0 top
C25  0.1uF  [C0805']  40.94,13.34 180 bottom
C26  40.89,10.08 0 bottom
C27  21.56,39.85 90 top
C28  92.43,46.84 0 top
C31  80.62,63.09 180 top
C35  89.76,65.94 180 top
CN2  81.28,0 0 top
D1  60.33,60.93 180 bottom
D2  39.17,69.75 0 top
D3  22.53,69.95 270 top
D4  82.55,73.79 270 top
D5  76.45,71.63 180 top
D6  76.45,67.56 180 top
GNDINT  4.83,11.18 0 top
IC1  80.87,55.09 180 top
J2  23.22,6.07 0 top
J4  69.11,73.18 90 top
JP1  29.44,27.08 180 top
JP2  4.6,43.79 0 top
JP3  58.42,79.78 0 top
JP4  76.96,77.22 180 top
JP5  40.39,77.72 90 top
JP6  12.7,77.72 90 top
JP9  72.42,19.08 270 top
JP10  32.46,77.7 90 top
JP11  19.74,77.72 90 top
K1  60.3,65.38 90 top
L2  82.58,68.63 270 top
L4  74.96,25.27 0 bottom
L6  74.24,63.83 90 top
LED1  81.33,46.84 90 top
LED2  74.73,53.14 180 top
LED3  62.46,52.55 270 top
LED4  11.43,15.24 90 top
LED5  92.28,70.61 270 top
LED7  93.24,32.66 0 top
Q1  63.35,50.9 90 bottom
Q2  31.04,59.21 180 top
Q3  39.73,59.28 180 top
Q4  20.19,59.05 180 top
Q5  11.43,59.03 180 top
Q11  60.45,36.53 0 top
Q12  65.02,36.58 0 top
R1  59.54,50.9 270 bottom
R2  57.28,38.79 90 top
R3  69.14,18.67 270 bottom
R4  56.77,51 90 bottom
R5  62.76,39.85 90 top
R6  11.43,17.15 0 top
R7  91.03,12.75 0 bottom
R8  90.98,10.57 0 bottom
R9  67.94,53.85 270 top
R10  70.31,53.85 270 top
R12  87.12,70.66 180 top
R16  74.75,23.8 0 top
R17  57.89,52.55 180 top
R21  35.43,50.88 180 top
R22  65,33.55 180 top
R23  45.21,58.04 90 top
R24  85.95,46.84 0 top
R25  15.85,51.03 180 top
R26  25.88,58.14 90 top
R27  18.59,70.31 90 top
R28  33.02,74.3 0 top
R29  81.13,18.34 270 top
R30  24.89,18.03 180 bottom
R31  24.89,20.19 180 bottom
R32  28.22,13.56 180 top
R33  24.05,13.61 0 top
R34  38.15,38.71 90 top
R38  74.73,57.3 90 top
R39  93.17,28.73 270 top
R42  40.34,39.78 90 top
R43  60.43,33.55 180 top
R44  43.97,43.48 0 top
R45  43.08,41.1 90 top
RX1  91.26,10.92 90 top
RX2  68.4,58.01 0 top
RX3  20.7,17.91 270 top
S1  93.6,40.28 90 top
SJ3  87.17,42.55 0 top
STANDOFF1  5.08,78.74 0 top
STANDOFF2  91.44,78.74 0 top
STANDOFF3  91.44,5.08 0 top
STANDOFF4  5.08,5.08 0 top
TX1  91.24,12.67 90 top
TX2  70.33,57.99 0 top
TX3  20.7,20.19 270 top
U2  89.81,55.19 180 top
U3  87.66,18.64 180 top
U4  77.5,18.11 180 top
U5  69.06,65.43 0 top
U8  50.8,29.21 90 top
U9  84.18,41.07 180 top
U11  26.04,19.46 180 top
U12  76.61,32.26 0 top
U15  31.75,71.35 270 top
U16  14.53,70.21 0 top
U17  28.65,40.26 180 top
U18  50.9,40.41 180 top
U21  63.55,21.54 180 top
U$1  69.9,19.25 90 top
V+  4.83,17.15 0 top
Y1  86.36,33.38 90 top

### Tracks (layer width: path | path; a pad name or v marks a point on that pad's centre or on a via)
3.3V  (via drill 0.5)  (1 unrouted)
  Top 0.254: U5.1 66.55,61.75 66.55,53.29 66.99,52.85 R9.2 R10.2 72.5,52.85 v72.77,52.58 | U12.28 80.57,32.26 v80.42,32.11 | U12.40 75.81,36.23 v75.56,35.99 | U9.5 86.48,39.77 v86.64,39.93
  Top 0.406: U8.1 66.42,27.3 v67.08,26.65
  Top 0.61: U2.4 89,52 v89,46.84 C28.1 | v86.94,24.64 80.75,24.64 v79.4,23.29
  Bottom 0.254: C19.1 80.42,30.72 v80.42,32.11 80.37,32.16 77.52,32.16 | v75.56,35.99 76.95,35.99 C18.1 76.98,32.55 77.37,32.16 77.52,32.16 | L4.2 74.13,30.21 75.08,30.23 77.09,30.23 77.37,30.51 77.37,32 77.52,32.16 | R3.2 69.14,16.64 69.01,16.51 | v86.64,39.93 86.64,41.09 C4.1 88.28,41.26 88.37,41.17
  Bottom 0.305: v72.77,52.58 72.77,37.77 74.12,36.42 74.12,25.28 L4.2
  Bottom 0.406: v67.08,26.65 67.08,23.57 | 67.08,23.57 67.08,17.65 68.22,16.51 69.01,16.51 72.14,16.51 JP9.2 | L4.2 74.11,24.12 73.61,23.62 73.43,23.62 67.13,23.62 67.08,23.57
  Bottom 0.61: v89,46.84 89,44.83 88.37,44.2 88.37,41.17 88.37,26.06 v86.94,24.64 | v79.4,23.29 73.76,23.29 73.43,23.62
3V  (via drill 0.5)
  Top 0.254: U4.8 81.28,16.4 | 81.28,16.4 84.28,16.4 | 84.28,16.4 84.73,15.95 U3.17 | R29.2 81.13,16.55 81.28,16.4 | 84.28,16.4 84.28,17.48 84.71,17.91 85.72,17.91 v85.83,18.01
  Bottom 0.254: v85.83,18.01 85.83,18.9 86.08,19.15 86.58,19.15 C21.1
3V3SCL
  Top 0.254: R43.1 61.43,35.5 Q11.2 61.4,36.36 61.72,36.68 66.12,36.68 66.7,37.26 72.41,37.26 72.64,37.49 72.64,38.02 U12.44
3V3SDA
  Top 0.254: U12.1 66.66,36.26 Q12.2 65.97,33.58 R22.1
+3V3
  Top 0.254: Q11.1 59.5,33.63 R43.2 59.43,31.91 59.66,31.67 63.65,31.67 64.01,32.03 R22.2 64,35.5 Q12.1
+5V  (1 unrouted)
  Top 0.254: U18.9 56.76,42.69 C16.A | C16.A 60.21,43.3 C15.1 | U18.4 57.09,39.44 57.48,39.83 57.48,43.2 C16.A | R5.2 60.59,40.85 59.56,39.83 57.32,39.83 R2.2
  Top 0.406: IC1.2 75.34,59.89 74.73,59.28 R38.2 76.16,58.3 76.5,57.96 76.5,45.72 74.65,43.87 62.1,43.87 61.59,43.36 60.26,43.36 C15.1
  Top 0.813: C31.A 79.22,60.52 IC1.2
+12V  (via drill 0.6)
  Top 0.254: R12.2 86.12,66.03 86.03,65.94
  Top 0.61: K1.C1 56.49,53.07 R17.2
  Top 1.27: 82.55,67.26 82.55,67.75 L2.2
  Top 1.422: C35.+ 87.53,64.97 U2.3 87.43,59.89 IC1.1
  Top 1.676: 82.55,67.26 82.55,66.62 83.26,65.91 v83.26,65.86 83.34,65.94 86.03,65.94 C35.+
  Bottom 0.813: D1.C 58.12,58.48 K1.C1
  Bottom 1.676: U21.23 U21.22 55.09,6.3 54.15,7.24 54.15,59.79 55.27,60.91 57.58,60.91 57.63,60.86 58.05,60.86 D1.C 58.12,63.33 60.1,65.3 82.7,65.3 v83.26,65.86
BMS-RX
  Top 0.254: U8.2 66.65,28.58 68.35,30.28 68.35,34.14 68.86,34.65 70.79,34.65 U12.3
BMS-TX
  Top 0.254: U8.3 67.06,29.84 67.74,30.53 67.74,34.87 68.33,35.46 U12.2 | U12.2
CRNTA  (via drill 0.6)
  Top 0.254: U17.5 27.65,43.44 26.7,44.4 25.27,44.4 v24.97,44.09 | v26.21,51.46 31.14,51.46 31.67,50.93
  Top 0.813: Q2.2 31.04,51.56 31.67,50.93 33.98,50.93 R21.2
  Bottom 0.254: v24.97,44.09 24.97,50.22 v26.21,51.46
CRNTB
  Top 0.254: R25.2 14.45,45.67 14.76,45.36 26.82,45.36 28.14,44.04 U17.4
  Top 0.813: R25.2 11.84,51.03 10.92,51.94 10.92,55.75 11.89,56.72 11.89,57.12 11.81,57.2 11.81,56.55 Q5.2
GND  (via drill 0.5)  (2 unrouted)
  Top 0.254: U3.26 U3.25
  other vias: 69.24,32.84
  pour Top (rank 5): 53.34,0 73.53,0 96.39,-0.13 96.52,33.02 96.52,83.82 53.34,83.82
  pour Bottom (rank 4): 53.34,0 53.34,83.82 96.52,83.82 96.52,33.02 96.39,-0.13 73.53,0
GNDINT  (via drill 0.5, 0.6)
  other vias: 45.72,31.12 25.53,11.68
  pour Top: 0.25,18.8 14.73,18.8 17.65,21.97 17.65,28.45 19.43,30.23 44.07,30.23 45.59,31.75 48.39,31.75 48.77,31.37 48.77,0 0,0
  pour Bottom: 0,18.92 14.61,18.92 17.65,22.1 17.65,28.45 19.43,30.23 44.07,30.23 45.59,31.75 48.77,31.75 48.77,0.13 0.13,0.13 0.13,18.8
N$1
  Top 0.254: R39.1 93.19,31.56 LED7.A
N$2
  Top 0.254: U12.31 83.83,34.66 84.35,35.18 85.16,35.18 Y1.3 85.21,35.81 85.42,36.02 85.42,37.27 C24.1
N$3
  Top 0.406: U5.5 70.97,70.56 71.45,71.04 71.45,80.14 70.76,80.82 69.27,80.82 J4.4
N$4
  Top 0.254: U12.30 83.95,33.86 84.25,33.55 86.97,33.55 87.48,33.05 87.48,31.56 Y1.1 87.51,29.44 C3.1
N$5
  Top 0.254: SJ3.1 85.3,42.55 U9.1
N$6
  Top 0.305: CN2.D- 78.73,8.42 78.23,8.91 78.23,12.45 79.63,13.84 83.92,13.84 84.1,14.02 84.1,14.97 U3.16
N$7
  Top 0.305: LED1.A R24.1
N$8  (via drill 0.6)
  Top 0.305: U3.15 81.58,14.99 v81.36,15.22
  Bottom 0.305: v81.36,15.22 81.36,9.8 CN2.D+
N$9
  Top 0.305: R12.1 91.18,70.66 LED5.A
N$10  (via drill 0.6)
  Top 0.305: v94.23,12.95 93.98,12.7 92.31,12.7 TX1.A
  Bottom 0.305: R7.1 94.03,12.75 v94.23,12.95
N$11
  Top 0.406: J4.3 66.75,78.26 66.17,77.67 66.17,66.95 66.52,66.6 69.52,66.6 69.72,66.8 69.72,68.48 U5.6
N$12
  Top 0.406: U5.7 68.43,70.76 68.86,71.2 70.18,71.2 70.56,71.58 70.56,75.18 70.16,75.59 69.37,75.59 J4.2
N$13
  Top 0.406: J4.1 67.69,73.18 67.21,72.69 67.21,68.56 U5.8
N$14  (via drill 0.6)
  Top 0.305: RX1.A 94.23,10.92 v94.49,10.67
  Bottom 0.305: v94.49,10.67 92.08,10.67 R8.1
N$15
  Top 0.305: TX1.C 88.92,12.67 88.65,12.95 88.65,14.97 U3.23
N$16
  Top 0.305: RX1.C 88.77,10.92 88.01,11.68 88.01,14.96 U3.22
N$17
  Top 0.254: R10.1 70.31,57.24 TX2.A
N$18
  Top 0.254: U4.2 77.82,20.88 78.21,21.26 79.63,21.26 80.21,20.68 91.36,20.68 91.9,21.24 U3.1
N$19
  Bottom 1.676: JP3.2 61.09,70.89 59.26,69.06 57.05,69.06 56.44,68.45 56.44,66.7 K1.COM
N$20
  Top 0.254: U4.3 77.16,21.13 77.85,21.82 79.86,21.82 80.52,21.16 89.13,21.16 89.26,21.28 89.26,22.27 U3.5
N$21  (via drill 0.5)
  Top 0.254: U12.17 76.61,28.27 v76.99,28.65
  Bottom 0.254: L4.1 77.22,25.27 | 77.22,25.27 78.32,25.27 C1.1 | v76.99,28.65 76.99,25.5 77.22,25.27
N$22
  Top 0.406: LED2.A R38.1
N$23
  Bottom 1.676: JP3.1 58.29,75.13 57.4,74.24 56.52,74.24 K1.N.O
N$24
  Top 0.406: JP6.2 JP6.1 | JP6.1 12.7,72.39 | 12.7,72.39 12.7,72.38 U16.5 13.21,71.88 | R27.2 21.83,71.71 | 13.46,71.88 13.21,71.88 | 13.21,71.88 12.7,72.39 | JP6.1 12.7,81.79 13.46,82.55 22.61,82.55 23.11,82.04 23.11,72.99 D3.C
  Top 0.813: 21.83,71.71 D3.C
N$25
  Top 0.254: U11.6 25.4,13.96 R33.2 25.02,13.58 25.02,12.57 23.24,10.8 23.24,5.59 22.45,4.8 J2.3
N$27  (via drill 0.6)
  Top 0.254: v72.92,31.5 70.84,31.5 U12.7
  Bottom 0.254: C12.A 72.75,29.44 73.08,29.77 73.08,31.34 v72.92,31.5
N$28
  Top 0.254: R6.2 12.43,15.29 LED4.A
N$29
  Top 0.406: R28.2 39.5,74.3 40.39,75.18 JP5.1 JP5.2
N$32
  Top 0.61: LED3.C 63.5,52.53 63.96,52.98 63.96,56.39 K1.C2
  Bottom 0.406: Q1.3 64.45,55.9 K1.C2
  Bottom 0.61: D1.A 62.52,57.82 K1.C2
N$39
  Bottom 0.406: R4.1 59.44,50 R1.2 62.2,49.9 Q1.1
N$40
  Top 0.254: R9.1 67.94,55.32 68.45,55.83 68.45,57.19 RX2.A
N$41
  Top 0.254: U11.5 23.37,16.38 23.11,16.13 23.11,13.67 R33.1 23.05,12 23.11,12.06 22.86,11.81 21.95,10.85 J2.4
N$42
  Top 0.254: U11.8 29.08,16.38 29.34,16.13 29.34,13.68 R32.1 29.21,12.83 25.78,9.4 25.78,5.72 24.87,4.8 J2.5
N$43
  Top 0.254: U11.7 26.67,14.11 R32.2 27.18,13.52 27.18,11.81 24.49,9.12 J2.6
N$44
  Top 0.254: U12.22 92.8,26.46 93.19,26.7 93.19,27.17 R39.2
N$45  (via drill 0.5)
  Top 0.254: S1.2 93.6,42.11 92.84,41.35 88.82,41.35 | 88.82,41.35 SJ3.2 | R16.1 73.85,20.51 JP9.1 74.45,19.08 74.65,19.28 74.65,21.64 75.36,22.35 80.01,22.35 81.25,23.6 87.25,23.6 88.98,25.32 v91.21,25.32 | 88.82,41.35 88.82,29.19 89.28,28.73 90.47,28.73 v90.7,28.5
  Bottom 0.254: JP9.1 71.92,19.57 R3.1 69.14,21.48 C2.1 | v90.7,28.5 90.7,25.83 v91.21,25.32
N$46
  Top 0.254: R16.2 76.61,23.8 77.42,24.61 77.42,26.45 U12.18
N$47
  Top 0.254: U12.8 69.47,30.66 69.11,30.3 69.11,12.17 69.8,11.48 72.14,11.48 JP9.4
N$48
  Top 0.254: U12.9 69.84,29.86 69.62,29.64 69.62,13.34 70.26,12.7 74.37,12.7 74.8,12.27 74.8,9.22 74.55,8.97 72.47,8.97 JP9.5
N$49
  Top 0.406: R17.1 LED3.A
N$55
  Top 0.406: JP10.2 JP10.1 33.05,76.98 U15.5 U15.4 33.05,70.36 34.8,70.36 35.15,69.75 D2.C
N$56
  Top 0.813: D3.A 22.53,63.15 Q4.1 25.27,63.09 25.88,62.48 R26.2
N$57  (via drill 0.6)
  Top 0.254: U18.17 45.48,39.44 v45.29,39.24 | U18.12 46.14,42.69 45.9,42.93 45.9,43.36 45.8,43.46 44.89,43.46 R44.2 44.88,43.5 v44.88,44.73 44.86,44.75 40.74,44.75 40.34,44.35 R42.2 38.39,40.68 38.12,40.41 38.12,39.64 R34.2 | C27.1 21.56,38.61 21.92,38.25 24.44,38.25 C14.A 26.16,38.3 26.47,38.61 26.47,39.29 26.72,39.55 28.35,39.55 28.65,39.24 U17.8 28.65,37.01 v28.93,36.73
  Bottom 0.254: v45.29,39.24 45.29,44.32 v44.88,44.73 43.94,43.79 42.24,43.79 | 42.24,43.79 40.34,43.79 39.73,43.18 C17.1 39.71,42.24 37.97,42.24 37.59,41.86 37.59,36.96 37.36,36.73 v28.93,36.73 | 42.24,43.79 C20.A
N$58
  Top 0.406: U16.4 15.48,74.41 16.26,75.18 19.3,75.18 19.81,75.69 19.81,77.52 JP11.1 JP11.2
N$59
  Top 0.406: D2.A 41.62,64.4 42.42,63.6
  Top 0.813: R23.2 45.21,62.84 44.45,63.6 42.42,63.6 42.28,63.6 Q3.1
N$60
  Top 0.254: U18.19 46.44,38.14 46.23,37.92 38.26,37.92 R34.1 29.99,37.81 U17.10
N$61
  Top 0.406: U16.3 18.54,68.91 18.92,69.29 18.92,69.24 R27.1
N$62
  Top 0.406: Q3.3 33.39,63.32 Q2.1 33.27,63.29 33.27,66.55 32.77,67.06 28.96,67.06 28.45,67.56 28.45,70.87 28.93,71.35 U15.2
N$63
  Top 0.406: U15.1 27.85,72.3 26.92,71.37 26.92,66.29 27.69,65.53 28.45,65.53 28.7,65.28 28.7,63.3 Q2.3
N$64
  Top 0.406: U16.1 9.85,68.91 9.2,68.25 9.2,63.11 Q5.3
N$65
  Top 0.406: U16.2 14.53,65.73 13.69,64.9 13.69,63.09 Q5.1 17.89,63.07 Q4.3
N$66
  Top 0.406: R28.1 31.62,73.41 31.75,73.28 31.75,70.61 31.5,70.36 30.49,70.36 U15.3
N$67
  Top 0.254: U18.18 46.36,38.79 46,38.43 43.16,38.43 42.67,38.91 40.37,38.91 R42.1 40.12,38.66 30.81,38.66 30.28,39.19 29.41,39.19 29.15,38.93 U17.9
N$68
  Top 0.254: R44.1 R45.2 43.7,42 43.76,42.06 46.98,42.06 U18.13
N$69
  Top 0.254: U4.7 77.82,17.78 78.13,18.09 79.63,18.09 79.78,18.24 79.78,19.18 80.11,19.51 81.03,19.51 R29.1
N$73  (via drill 0.6)
  Top 0.406: v19.68,16.13 19.68,17.87 RX3.A
  Bottom 0.406: R30.1 19.78,18.03 RX3.A 19.65,16.16 v19.68,16.13
N$74  (via drill 0.6)
  Top 0.406: v19.56,21.84 19.56,20.29 TX3.A
  Bottom 0.406: R31.1 20.45,20.19 19.56,21.08 v19.56,21.84
N$85  (via drill 0.5)  (1 unrouted)
  Top 0.254: 86.69,14.98 86.69,16.71 v86.84,16.87 | v89.92,24.13 89.92,22.31 U3.4
  Top 0.305: CN2.VBUS 79.68,12.5 80.39,13.21 86.03,13.21 86.69,13.87 86.69,14.98 U3.20
  Bottom 0.254: v86.84,16.87 88.9,16.87 C22.A 88.95,19.34 C23.1 89.02,20.59 89.31,20.88 89.76,20.88 89.97,21.08 89.97,24.08 v89.92,24.13
  Bottom 0.305: R8.2 89.98,12.7 R7.2
N$88
  Top 1.422: L6.2 74.24,67.4 D6.A
  Top 1.93: D6.A 74.4,71.48 D5.A 74.25,77.17 JP4.2
N$89
  Top 1.93: JP4.1 81.27,77.22 D4.A
N$91
  Top 1.422: D4.C 82.55,69.51 L2.1
  Top 1.93: D4.C 78.66,71.64 D5.C 78.65,67.71 D6.C
PIC1
  Top 0.406: RX3.C 23.11,17.91 23.49,18.29 26.29,18.29 26.67,18.67 U11.2 26.67,24.89 26.8,25.02 26.8,27.23 JP1.2 26.9,29.06 27.3,29.46 44.2,29.46 45.09,28.58 U8.7
PIC2
  Top 0.406: TX3.C 24.77,20.19 25.4,20.83 U11.3 25.4,23.75 24.38,24.77 24.38,27.05 JP1.3 24.38,27.1 24.38,29.34 25.27,30.23 44.58,30.23 44.96,29.84 U8.6
RX2  (via drill 0.6)
  Top 0.254: U5.2 v68.43,60.5 RX2.C | U12.4 72.49,33.86 72.69,34.06 v72.69,34.95
  Bottom 0.254: v72.69,34.95 71.75,34.95 71.17,35.53 71.22,62.15 70.69,62.66 68.73,62.66 U5.2 v68.43,60.5
RX3  (via drill 0.5)
  Top 0.254: U12.37 78.21,39.52 v78.69,40 | v77.32,14.58 77.16,14.73 U4.6
  Bottom 0.254: v78.69,40 83.41,40 84.12,39.29 84.12,17.8 83.36,17.04 77.8,17.04 U4.6 77.17,14.73 v77.32,14.58
SCL
  Top 0.254: U18.2 57.48,38.14 | 57.48,38.14 60.25,38.14 Q11.3 | R2.1 57.28,37.93 57.48,38.14
SDA
  Top 0.254: U18.3 62.46,38.79 | 62.46,38.79 64.95,38.79 65,38.73 Q12.3 | R5.1 62.52,38.85 62.46,38.79
TX2  (via drill 0.6)
  Top 0.254: U5.3 69.7,61.09 69.85,60.94 v70.16,60.6 70.38,60.4 70.38,59.42 TX2.C | U12.5 72.81,33.06 v73,32.87
  Bottom 0.254: v73,32.87 71.4,32.87 70.31,33.96 70.31,60.48 v70.16,60.6
TX3  (via drill 0.5)
  Top 0.254: U12.38 77.41,40.86 77.93,41.38 79.58,41.38 v79.76,41.2 | v76.3,13.59 76.2,13.59 76.1,13.69 76.1,15.99 U4.5
  Bottom 0.254: v79.76,41.2 83.16,41.2 84.73,39.62 84.73,17.32 83.74,16.33 78.44,16.33 78.03,15.93 78.03,15.32 78.36,14.99 78.36,13.92 77.9,13.46 76.43,13.46 v76.3,13.59
V+  (via drill 0.6)
  Top 0.254: R6.1 V+.1
  Top 0.406: v30.1,22.35 28.12,22.35 U11.1 | U8.8 47.73,26.26 v47.12,25.65
  Bottom 0.406: V+.1 7.75,17.15 8.13,16.76 8.13,9.14 9.91,7.37 19.38,7.37 J2.2 | C26.+ 38.27,13.25 38.48,13.46 39.87,13.46 C25.1 39.99,17.16 | 39.99,17.16 39.75,17.4 31.11,17.4 30.23,18.29 26.15,18.29 | 26.15,18.29 R30.2 | 26.15,18.29 26.15,19.94 R31.2 29.72,20.19 30.1,20.57 v30.1,22.35 | v47.12,25.65 47.12,19.05 45.21,17.15 40,17.15 39.99,17.16
  Bottom 1.27: U21.14 38.27,6.42 C26.+ 20.62,10.08 19.43,8.89 19.43,7.37 | 19.43,7.37 19.43,4.83 J2.1 | J2.2 19.43,7.37
V-  (via drill 0.6)
  Top 0.254: 47.93,41.35 47.93,43.23 47.82,43.34 U18.11 v46.99,46.15 46.99,47.37 46,48.36 35.89,48.36 | 47.93,41.35 47.93,40.08 | 47.93,40.08 47.93,37.62 47.8,37.49 U18.20 | 47.93,40.08 47.92,40.09 U18.16 46.35,40.09 46.2,40.23 44.3,40.23 | U18.14 47.89,41.39 47.93,41.35 | 44.3,40.23 43.12,40.23 R45.1 | v44.37,41.12 44.37,40.31 44.3,40.23 | 28.65,41.4 28.35,41.1 C14.C 24.14,40.75 C27.2 20.08,40.75 v19.74,41.1 | 28.65,41.4 U17.3 | U17.1 29.65,41.54 29.52,41.4 28.65,41.4
  Top 0.813: R26.1 20.74,56.74 Q4.2 20.14,56.15 20.14,51.84 19.33,51.03 R25.1 17.6,50.68 17.6,49.4 v18.39,48.39 18.85,48.39 35.89,48.36 36.91,49.38 36.91,50.8 R21.1 39.14,50.88 39.62,51.36 39.62,56.32 Q3.2 39.97,56.19 40.28,56.19 40.74,56.64 R23.1
  Top 1.016: v18.39,48.39 18.85,48.39
  Bottom 0.254: C17.2 41.01,40.45 41.22,40.66 42.47,40.66 C20.C 43.96,40.71 v44.37,41.12 | v19.74,41.1 34.87,41.1 35.66,41.89 36.04,42.24 38.86,45.06 39.39,45.62 39.9,46.13 46.96,46.13 v46.99,46.15
  Bottom 1.016: JP2.2 14.81,43.79 v18.39,48.39
  Bottom 1.93: JP2.1 JP2.2
WDI
  Top 0.305: U12.10 74.37,29.06 74.8,29.49 74.8,34.11 75.44,34.75 80.16,34.75 80.75,35.33 80.75,36.35 81.76,37.36 82.83,37.36 83.24,37.77 U9.4

### Text on the board
Top: HV | HIGH VOLTAGE | HV
tNames: RJ